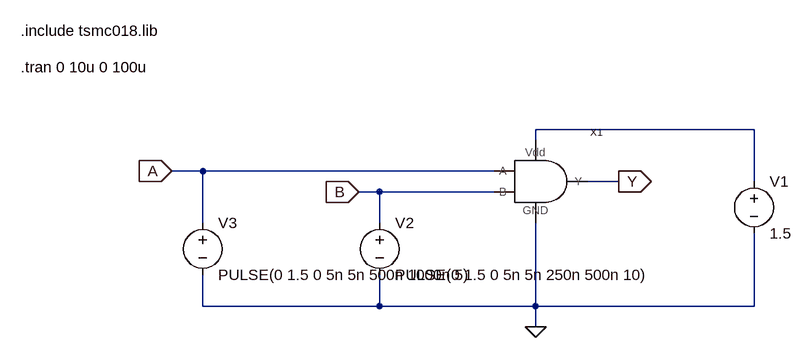
[diagram p0: schematic and_cmos_tb.asc]
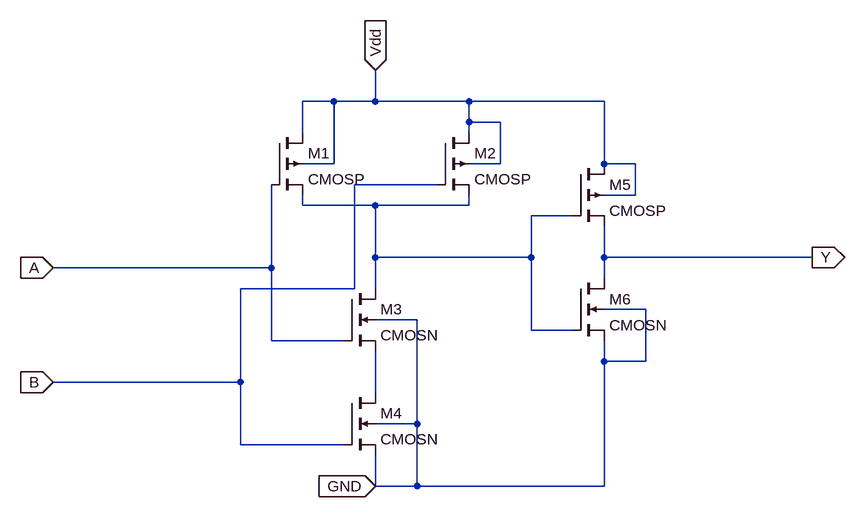
[diagram p1: sub-circuit and_cmos.asc]
and_cmos_tb.asc, the LTspice schematic file:
Version 4
SHEET 1 880 680
WIRE 544 128 208 128
WIRE 208 144 208 128
WIRE -304 192 -352 192
WIRE 144 192 -304 192
WIRE 336 208 288 208
WIRE 544 208 544 128
WIRE -32 224 -64 224
WIRE 144 224 -32 224
WIRE -304 272 -304 192
WIRE -32 272 -32 224
WIRE -304 400 -304 352
WIRE -32 400 -32 352
WIRE -32 400 -304 400
WIRE 208 400 208 272
WIRE 208 400 -32 400
WIRE 544 400 544 288
WIRE 544 400 208 400
WIRE 208 432 208 400
FLAG 336 208 Y
IOPIN 336 208 Out
FLAG 208 432 0
FLAG -352 192 A
IOPIN -352 192 In
FLAG -64 224 B
IOPIN -64 224 In
SYMBOL and_cmos 176 176 R0
SYMATTR InstName X1
SYMBOL voltage 544 192 R0
WINDOW 123 0 0 Left 0
WINDOW 39 0 0 Left 0
SYMATTR InstName V1
SYMATTR Value 1.5
SYMBOL voltage -32 256 R0
WINDOW 123 0 0 Left 0
WINDOW 39 0 0 Left 0
SYMATTR InstName V2
SYMATTR Value PULSE(0 1.5 0 5n 5n 250n 500n 10)
SYMBOL voltage -304 256 R0
WINDOW 123 0 0 Left 0
WINDOW 39 0 0 Left 0
SYMATTR InstName V3
SYMATTR Value PULSE(0 1.5 0 5n 5n 500n 1000n 5)
TEXT -584 -24 Left 2 !.include tsmc018.lib
TEXT -584 32 Left 2 !.tran 0 10u 0 100u

and_cmos.asc, the sub-circuit schematic file:
Version 4
SHEET 1 1020 696
WIRE 208 32 160 32
WIRE 272 32 272 -16
WIRE 272 32 208 32
WIRE 416 32 272 32
WIRE 624 32 416 32
WIRE 416 64 416 32
WIRE 464 64 416 64
WIRE 160 80 160 32
WIRE 416 80 416 64
WIRE 208 128 208 32
WIRE 208 128 160 128
WIRE 464 128 464 64
WIRE 464 128 416 128
WIRE 624 128 624 32
WIRE 672 128 624 128
WIRE 368 160 240 160
WIRE 672 176 672 128
WIRE 672 176 624 176
WIRE 160 192 160 176
WIRE 272 192 160 192
WIRE 416 192 416 176
WIRE 416 192 272 192
WIRE 576 208 512 208
WIRE 272 272 272 192
WIRE 512 272 512 208
WIRE 512 272 272 272
WIRE 624 272 624 224
WIRE 944 272 624 272
WIRE 112 288 112 160
WIRE 112 288 -224 288
WIRE 624 304 624 272
WIRE 240 320 240 160
WIRE 240 320 64 320
WIRE 272 320 272 272
WIRE 688 352 624 352
WIRE 336 368 272 368
WIRE 512 384 512 272
WIRE 576 384 512 384
WIRE 112 400 112 288
WIRE 224 400 112 400
WIRE 624 432 624 400
WIRE 688 432 688 352
WIRE 688 432 624 432
WIRE 64 464 64 320
WIRE 64 464 -224 464
WIRE 272 480 272 416
WIRE 336 528 336 368
WIRE 336 528 272 528
WIRE 64 560 64 464
WIRE 224 560 64 560
WIRE 272 624 272 576
WIRE 336 624 336 528
WIRE 336 624 272 624
WIRE 624 624 624 432
WIRE 624 624 336 624
FLAG 272 -16 Vdd
IOPIN 272 -16 In
FLAG 272 624 GND
IOPIN 272 624 In
FLAG -224 288 A
IOPIN -224 288 In
FLAG -224 464 B
IOPIN -224 464 In
FLAG 944 272 Y
IOPIN 944 272 Out
SYMBOL cmosp 112 80 R0
SYMATTR InstName M1
SYMATTR Value2 l=180n w=1u
SYMBOL cmosp 368 80 R0
SYMATTR InstName M2
SYMATTR Value2 l=180n w=1u
SYMBOL cmosn 224 320 R0
SYMATTR InstName M3
SYMATTR Value2 l=180n w=1u
SYMBOL cmosn 224 480 R0
SYMATTR InstName M4
SYMATTR Value2 l=180n w=1u
SYMBOL cmosp 576 128 R0
SYMATTR InstName M5
SYMBOL cmosn 576 304 R0
SYMATTR InstName M6

The netlist it stands for:
* and_cmos_tb.asc
XX1 Y N001 0 A B and_cmos
V1 N001 0 1.5
V2 B 0 PULSE(0 1.5 0 5n 5n 250n 500n 10)
V3 A 0 PULSE(0 1.5 0 5n 5n 500n 1000n 5)

* block symbol definitions
.subckt and_cmos Y Vdd GND A B
M1 Vdd A N001 Vdd CMOSP l=180n w=1u
M2 Vdd B N001 Vdd CMOSP l=180n w=1u
M3 N001 A N002 GND CMOSN l=180n w=1u
M4 N002 B GND GND CMOSN l=180n w=1u
M5 Vdd N001 Y Vdd CMOSP
M6 Y N001 GND GND CMOSN
.ends and_cmos

.model NMOS NMOS
.model PMOS PMOS
.lib standard.mos
.include tsmc018.lib
.tran 0 10u 0 100u
.backanno
.end